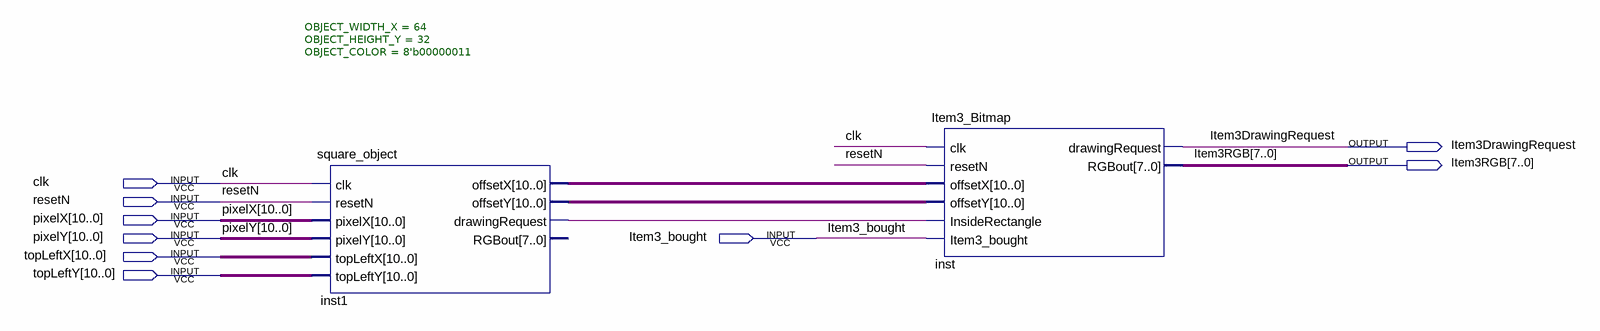
[diagram p0: schematic sheet]
// Quartus schematic Item3_Display.bdf as structural Verilog: 2 symbols, 9 pins
module Item3_Display (
  input  clk,
  input  resetN,
  input  [10:0] pixelX,
  input  [10:0] pixelY,
  input  Item3_bought,
  input  [10:0] topLeftX,
  input  [10:0] topLeftY,
  output Item3DrawingRequest,
  output [7:0] Item3RGB
);

  wire inst1_drawingrequest;
  wire [10:0] inst1_offsetx, inst1_offsety;

  square_object #(.OBJECT_WIDTH_X(64), .OBJECT_HEIGHT_Y(32), .OBJECT_COLOR(8'b00000011)) inst1 (
    .clk(clk), .resetN(resetN), .pixelX(pixelX), .pixelY(pixelY), .topLeftX(topLeftX), .topLeftY(topLeftY),
    .offsetX(inst1_offsetx), .offsetY(inst1_offsety), .drawingRequest(inst1_drawingrequest));  // open: RGBout
  Item3_Bitmap inst (
    .clk(clk), .resetN(resetN), .offsetX(inst1_offsetx), .offsetY(inst1_offsety),
    .InsideRectangle(inst1_drawingrequest), .Item3_bought(Item3_bought),
    .drawingRequest(Item3DrawingRequest), .RGBout(Item3RGB));
endmodule
